# EAGLE design HV DCDC 4-22-2016  (EAGLE 7.2.0)
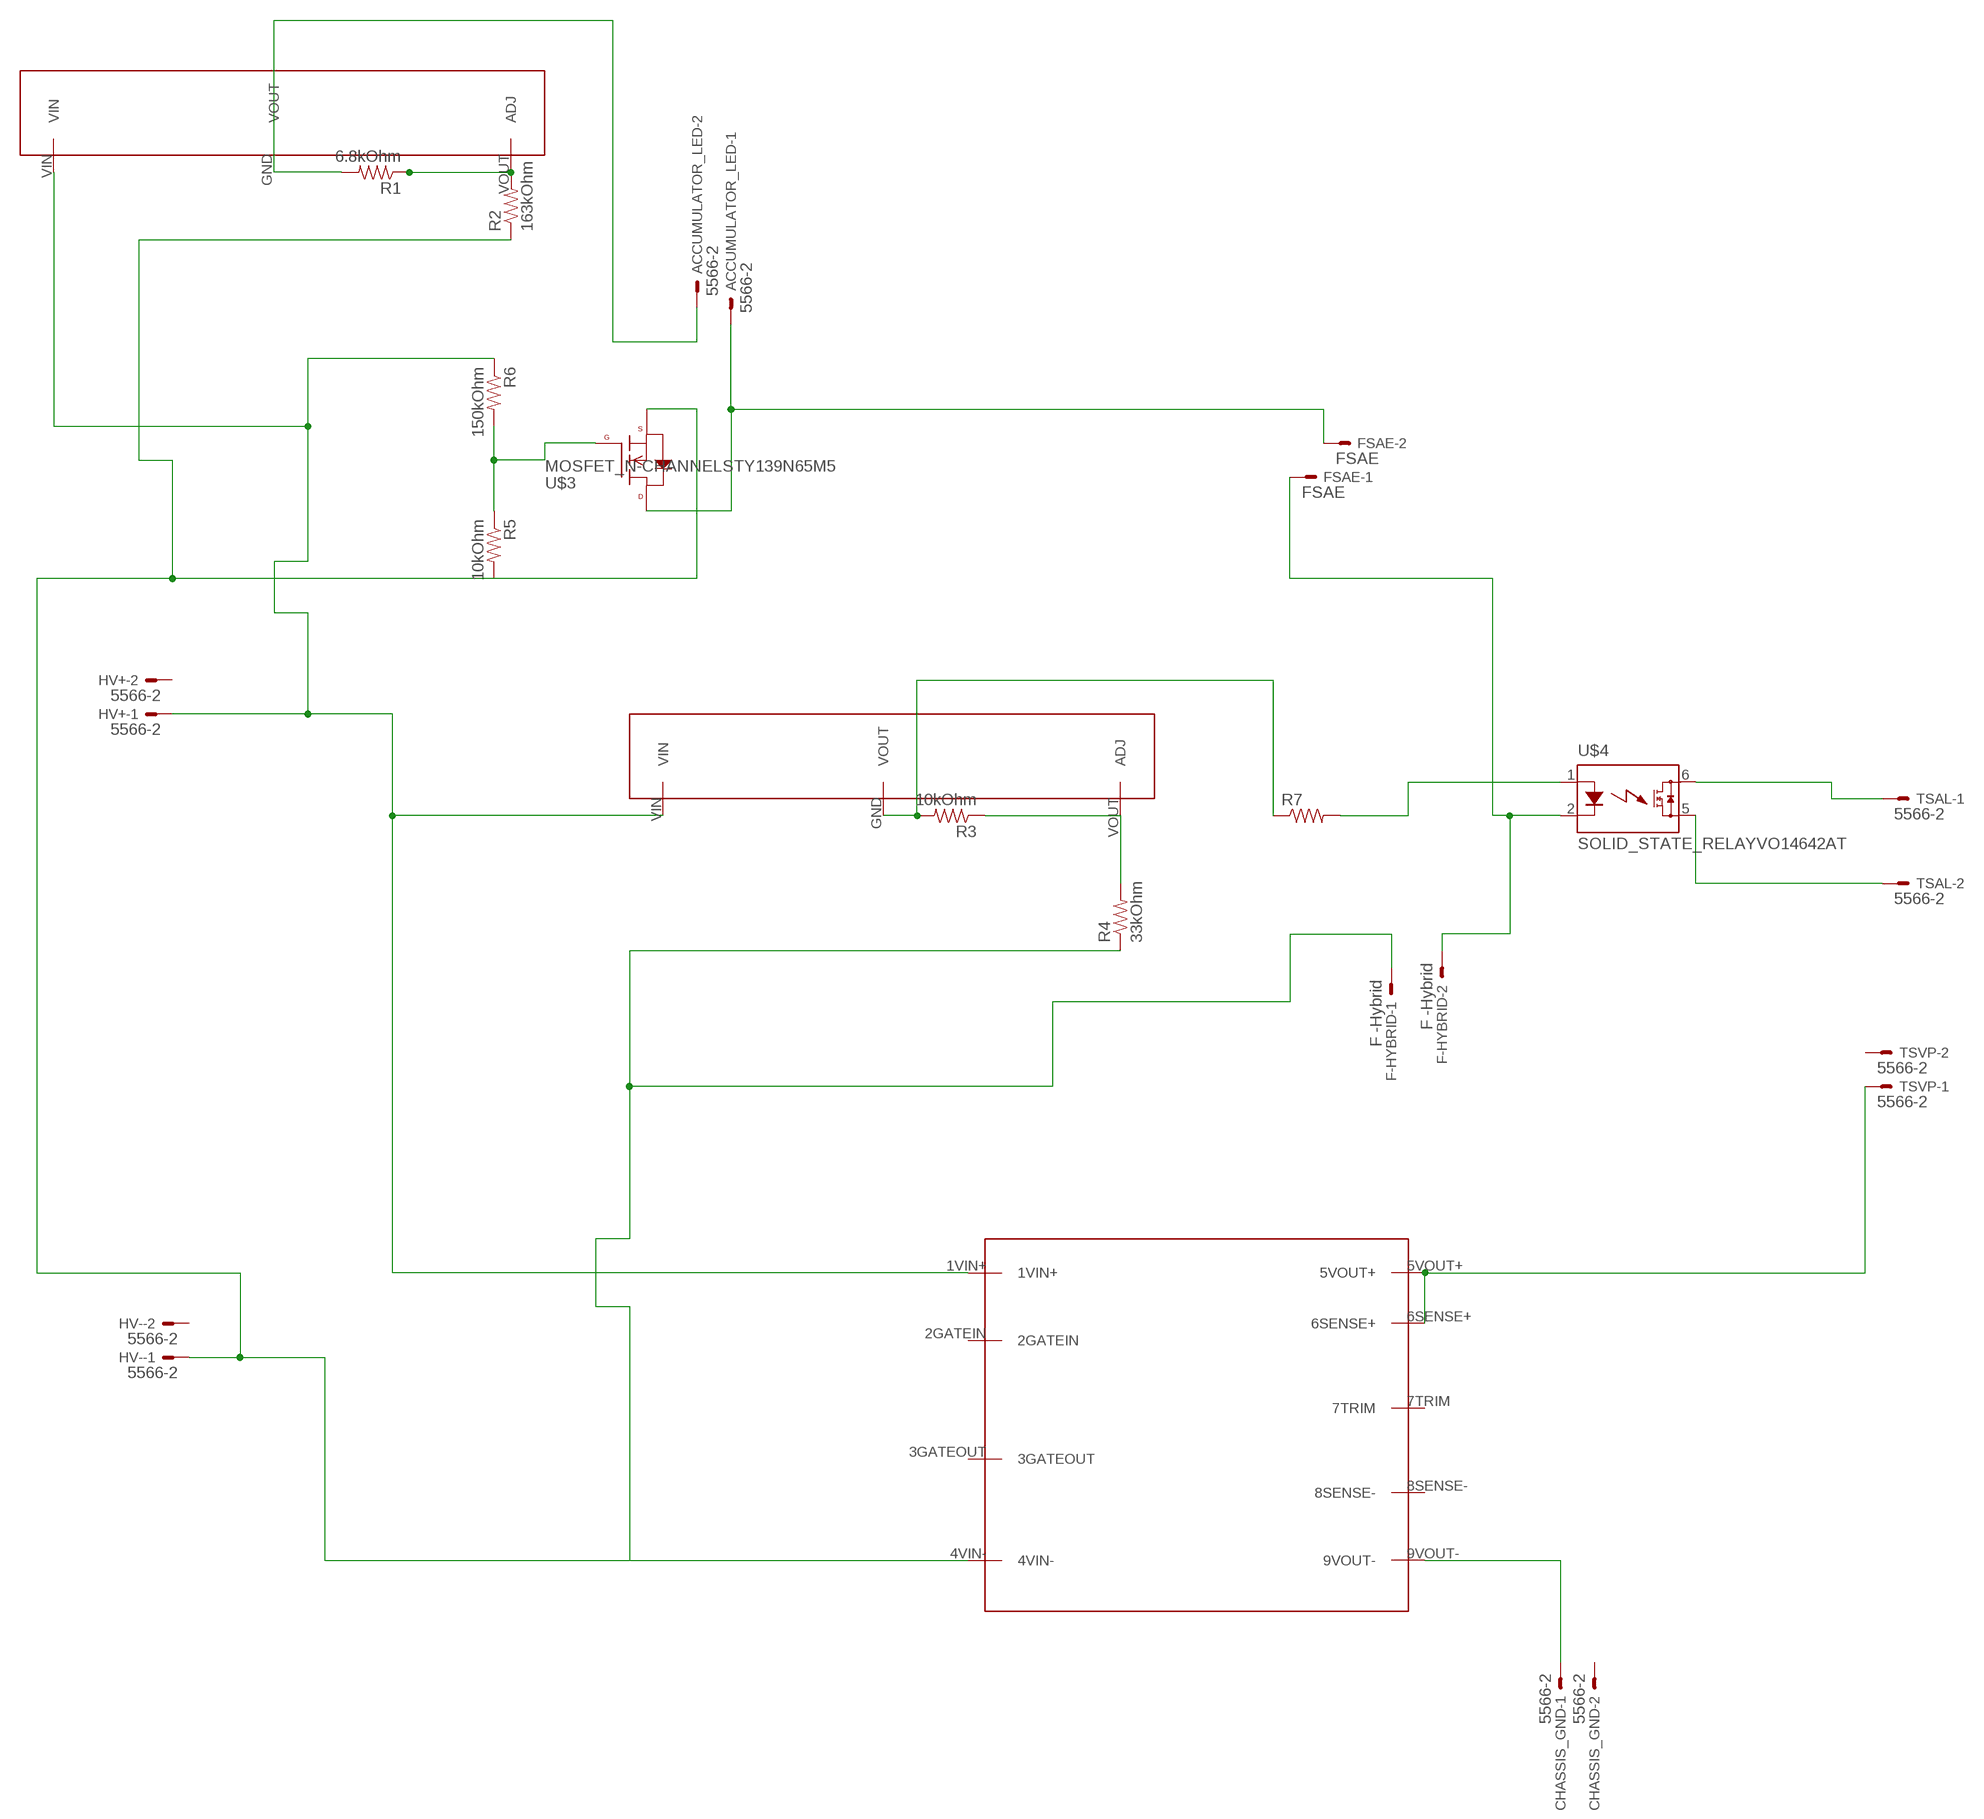
[diagram p0: schematic, sheet 1]

## Parts
ACCUMULATOR_LED  5566-2  [5566-2]
CHASSIS_GND  5566-2  [5566-2]
F-HYBRID  F -Hybrid  5566-2  [5566-2]
FSAE  FSAE  5566-2  [5566-2]
HV+  5566-2  [5566-2]
HV-  5566-2  [5566-2]
R1  6.8kOhm  RESISTORAXIAL-0.3  [AXIAL-0.3]
R2  163kOhm  RESISTORAXIAL-0.3  [AXIAL-0.3]
R3  10kOhm  RESISTORAXIAL-0.3  [AXIAL-0.3]
R4  33kOhm  RESISTORAXIAL-0.3  [AXIAL-0.3]
R5  10kOhm  RESISTORAXIAL-0.3  [AXIAL-0.3]
R6  150kOhm  RESISTORAXIAL-0.3  [AXIAL-0.3]
R7  RESISTORAXIAL-0.3  [AXIAL-0.3]
TSAL  5566-2  [5566-2]
TSVP  5566-2  [5566-2]
U$3  MOSFET_N-CHANNELSTY139N65M5  [TO-264_MAX247]
U$4  SOLID_STATE_RELAYVO14642AT  [DIL06]
U$5  HV_DCDC_NEW  [HV_DCDC_NEW]
U$6  HV_LIN_REG  [HV_LIN_REG14MM]
U$7  HV_LIN_REG  [HV_LIN_REG14MM]

## Nets
N$1: TSAL.1 U$4.6(IO1)
N$2: ACCUMULATOR_LED.1 FSAE.2 U$3.P2(DRAIN)
N$3: HV+.1 R6.P$1 U$5.1VIN+ U$6.VIN U$7.VIN
N$4: R5.P$1 R6.P$2 U$3.P1(GATE)
N$6: F-HYBRID.2 FSAE.1 U$4.2(LED-)
N$7: R3.P$2 R7.P$1 U$6.GND(VOUT)
N$8: R3.P$1 R4.P$2 U$6.VOUT(ADJ)
N$9: F-HYBRID.1 HV-.1 R2.P$1 R4.P$1 R5.P$2 U$3.P3(SOURCE) U$5.4VIN-
N$11: TSAL.2 U$4.5(IO2)
N$12: TSVP.1 U$5.5VOUT+ U$5.6SENSE+
N$13: R1.P$1 R2.P$2 U$7.VOUT(ADJ)
N$14: ACCUMULATOR_LED.2 R1.P$2 U$7.GND(VOUT)
N$18: CHASSIS_GND.1 U$5.9VOUT-
N$19: R7.P$2 U$4.1(LED+)
Unconnected: CHASSIS_GND.2 HV+.2 HV-.2 TSVP.2 U$5.2GATEIN U$5.3GATEOUT U$5.7TRIM U$5.8SENSE-

## Library data of the parts
ACCUMULATOR_LED CHASSIS_GND F-HYBRID FSAE HV+ HV- TSAL TSVP = con-molex:5566-2: Mini FIT connector 2 pol Source: http://www.molex.com; OC_FARNELL: 1822072; OC_NEWARK: unknown
R1-R7 = HyTech 2016-2-27-2016:RESISTOR: Resistor Basic schematic elements and footprints for 0603, 1206, and PTH resistors.
U$3 = HyTech 2016-2-27-2016:MOSFET_N-CHANNEL: N-Channel MOSFET Mode Field Effect Transistor
U$4 = HyTech 2016-2-27-2016:SOLID_STATE_RELAY: Configured for DC only
U$5 = HyTech 2016-4-19-2016:HV_DCDC_NEW
U$6 U$7 = HyTech 2016-4-19-2016:HV_LIN_REG

## Board
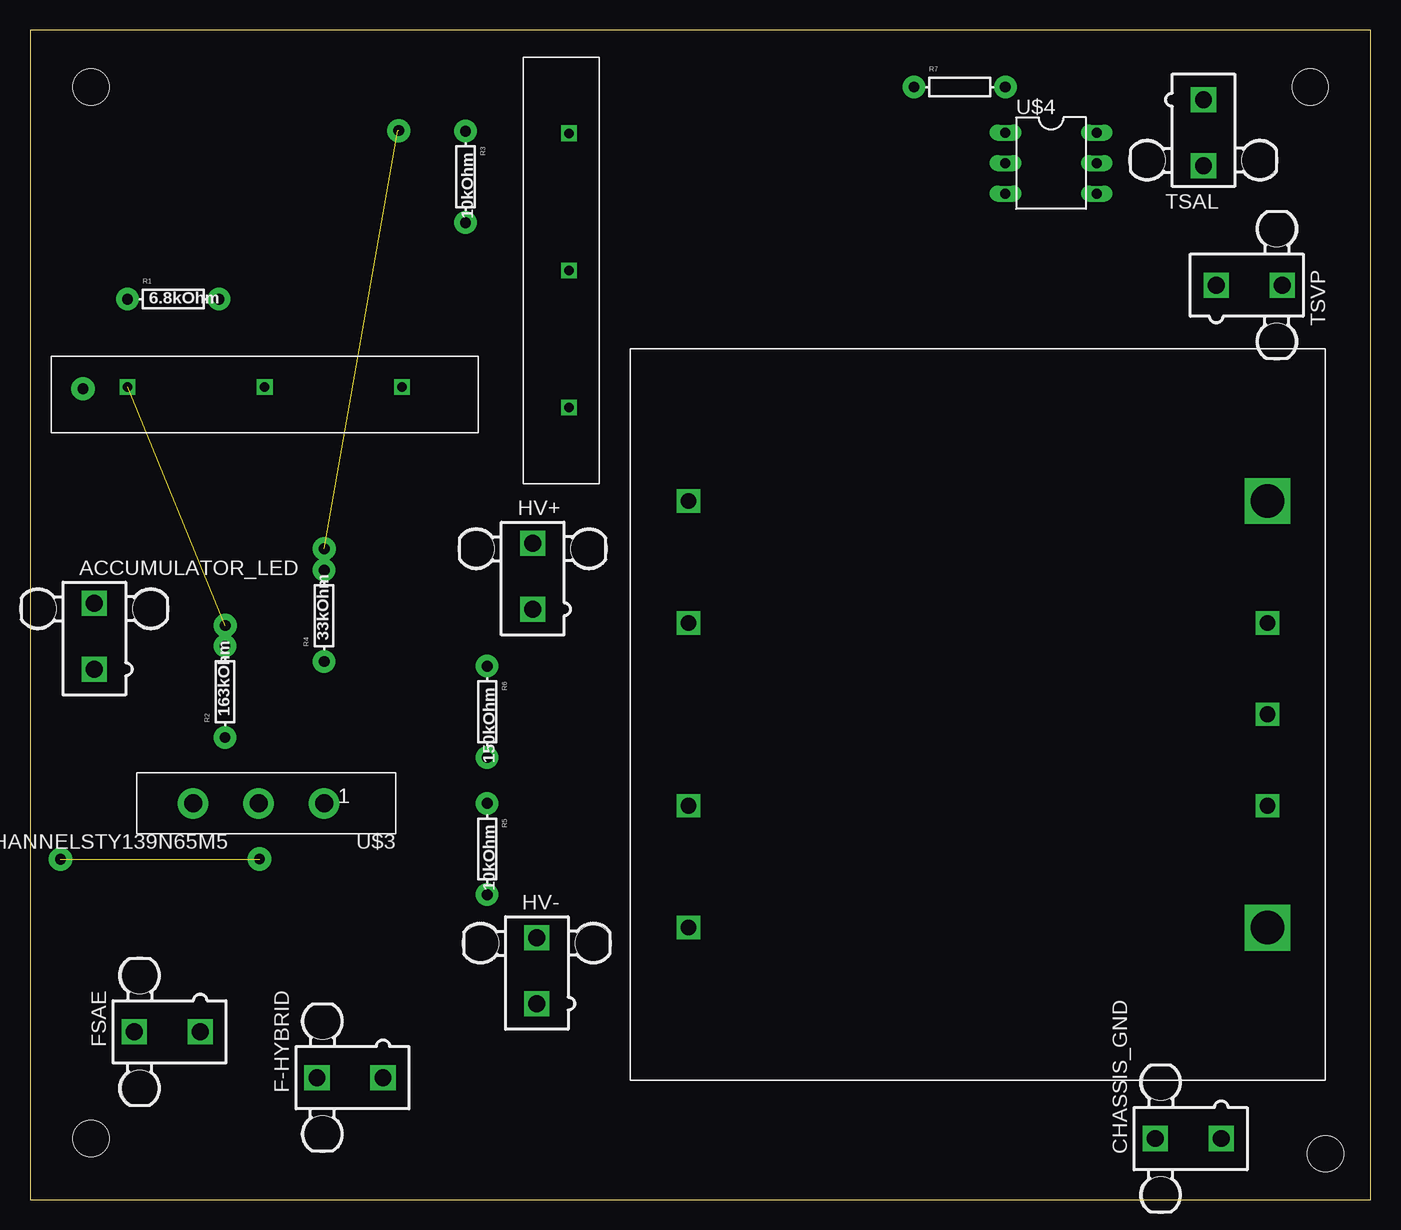
[diagram p1: board, top side]
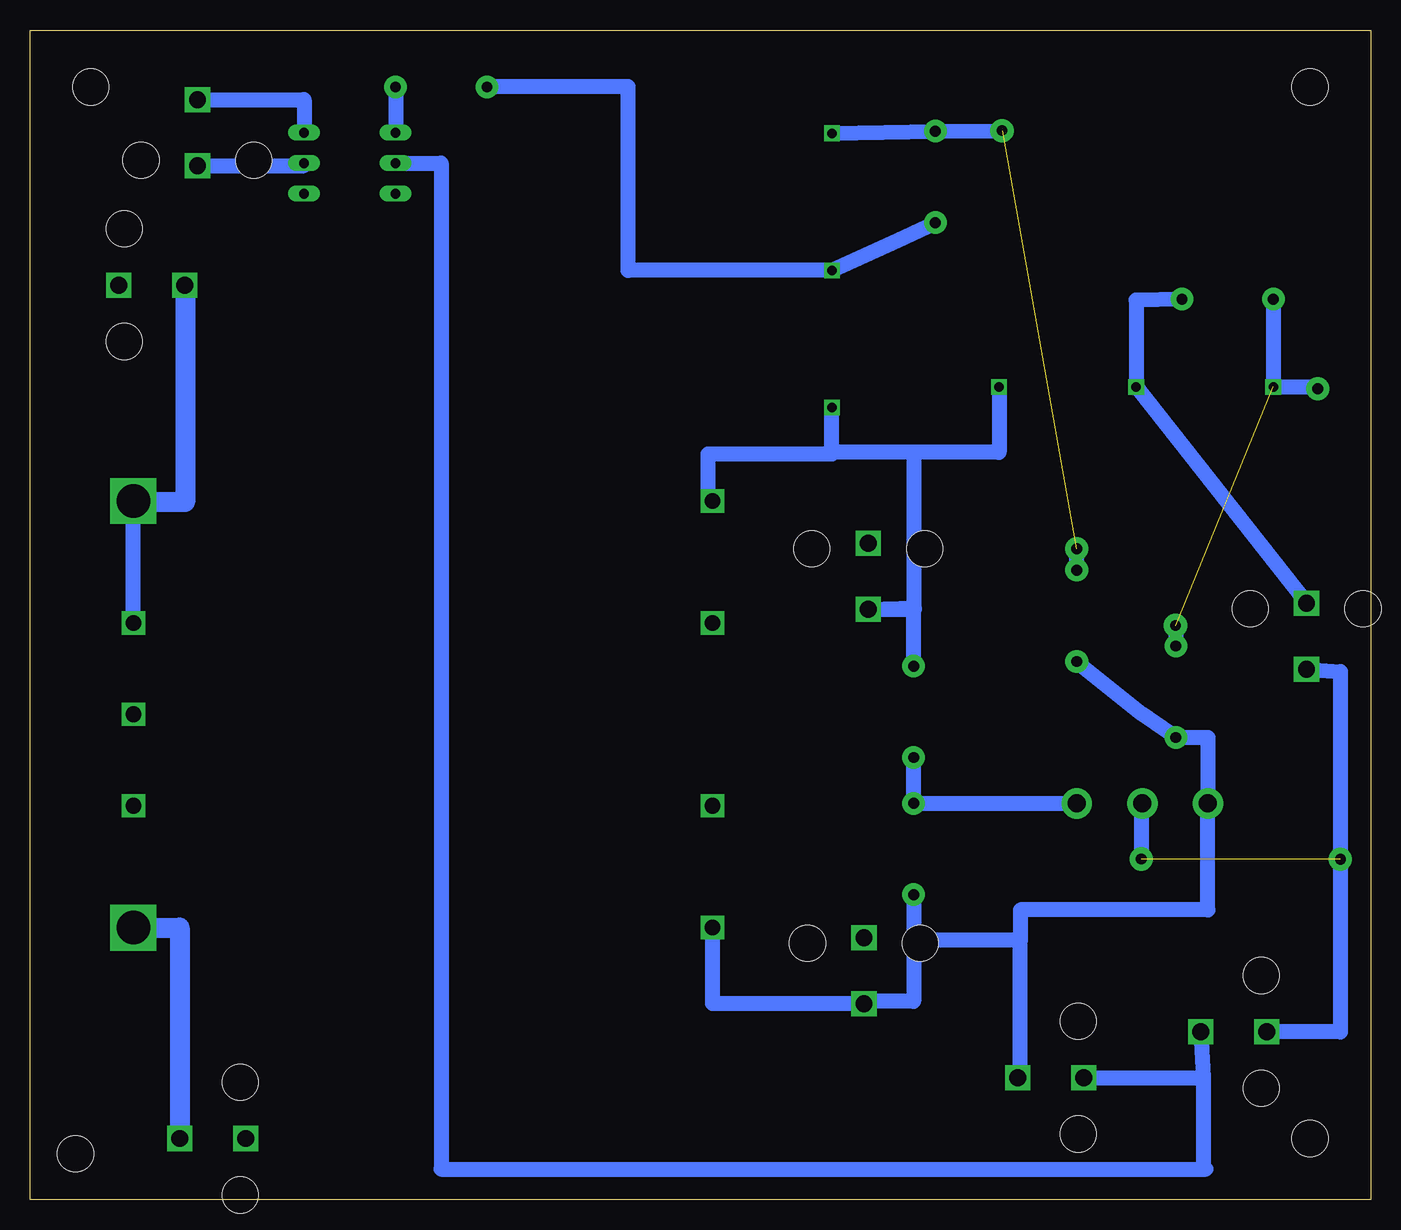
[diagram p2: board, bottom side, seen from below]

Size 111.74 x 97.46 mm. Coordinates in mm from the lower left corner, seen from the top.
Outline: 0,0 111.74,0 111.74,97.46 0,97.46 0,0
Copper layers (1*16): Top 0.035mm / dielectric 1.5mm / Bottom 0.035mm
Design rules "default": minimum track width 10mil, minimum drill 24mil, track to track 8mil, track to pad 8mil, pad to pad 8mil, via to via 8mil, smd to smd 8mil, copper to edge 40mil, drill to drill 8mil, minimum pad ring 10mil, minimum via ring 8mil, stop-mask expansion 4mil, vias tented up to drill 0mil, thermal gap 10mil
Holes 3 mm at 107.95,3.81 5.08,5.08 5.08,92.71 106.68,92.71

### Footprints (pad centres in the part's own frame; a part is rotated, then mirrored left to right if it is on the bottom)
5566-2 = drill 1.4 square: 1 0,-2.75; 2 0,2.75 | hole 3: 4.7,2.29; -4.7,2.29
AXIAL-0.3 = drill 0.9 pad 1.88: P$1 -3.81,0; P$2 3.81,0
TO-264_MAX247 = drill 1.5 pad 2.54: P1 -5.461,0; P2 0,0; P3 5.461,0
DIL06 = drill 0.813 long: 1 -2.54,-3.81; 2 0,-3.81; 3 2.54,-3.81; 4 2.54,3.81; 5 0,3.81; 6 -2.54,3.81
HV_DCDC_NEW = drill 1.3 square: 1VIN+ 5.08,-12.7; 2GATEIN 5.08,-22.86; 3GATEOUT 5.08,-38.1; 4VIN- 5.08,-48.26; 6SENSE+ 53.34,-22.86; 7TRIM 53.34,-30.48; 8SENSE- 53.34,-38.1 | drill 2.8 square: 5VOUT+ 53.34,-12.7; 9VOUT- 53.34,-48.26
HV_LIN_REG14MM = drill 0.8 square: GND 17.78,-3.81; VIN 6.35,-3.81; VOUT 29.21,-3.81

### Placement (x,y rotation side)
ACCUMULATOR_LED  5.36,46.94 0 top
CHASSIS_GND  96.52,5.08 90 top
F-HYBRID  26.67,10.16 90 top
FSAE  11.43,13.97 90 top
HV+  41.88,51.94 0 top
HV-  42.24,19.08 0 top
R1  11.94,75.03 0 top
R2  16.26,42.32 90 top
R3  36.3,85.22 270 top
R4  24.51,48.64 90 top
R5  38.1,29.21 270 top
R6  38.1,40.64 270 top
R7  77.47,92.71 0 top
TSAL  97.79,88.9 180 top
TSVP  101.6,76.2 270 top
U$3  19.05,33.02 180 top
U$4  85.09,86.36 270 top
U$5  49.78,70.92 0 top
U$6  41.1,59.64 90 top
U$7  37.34,63.91 180 top

### Tracks (layer width: path | path; a pad name or v marks a point on that pad's centre or on a via)
N$1
  Bottom 1.27: TSAL.1 88.9,91.65 U$4.6
N$2  (via drill 0.9 pad 1.93)  (1 unrouted)
  Bottom 1.27: FSAE.2 2.54,13.97 v2.54,28.35 2.54,43.99 ACCUMULATOR_LED.1 | U$3.P2 19.13,33.02 v19.13,28.37 19.13,28.3
N$3
  Bottom 1.27: R6.P$1 38.1,49.32 HV+.1 38.05,49.19 38.05,62.26 | U$5.1VIN+ 55.22,58.22 55.22,62.13 44.91,62.13 U$6.VIN 44.91,62.26 38.05,62.26 | U$7.VIN 30.99,62.26 38.05,62.26
N$4
  Bottom 1.27: R6.P$2 R5.P$1 U$3.P1
N$6
  Bottom 1.27: U$4.2 77.47,86.36 77.47,2.54 13.97,2.54 | 13.97,2.54 13.76,2.54 | FSAE.1 13.97,10.16 | 13.97,10.16 13.97,2.54 | F-HYBRID.2 13.97,10.16
N$7
  Bottom 1.27: R7.P$1 73.66,92.74 61.9,92.74 61.9,77.42 U$6.GND 39.42,79.93 R3.P$2
N$8  (via drill 0.9 pad 1.93)  (2 unrouted)
  Bottom 1.27: U$6.VOUT 36.27,89.03 R3.P$1 30.66,89.05 | R4.P$2 v24.51,54.23
  other vias: 30.73,89.08
N$9
  Bottom 1.27: R5.P$2 38.1,21.59 | 38.1,21.59 38.1,16.51 42.24,16.51 HV-.1 54.86,16.33 U$5.4VIN- | 29.21,21.59 38.1,21.59 | F-HYBRID.1 29.21,10.16 29.21,21.59 | 29.21,21.59 29.21,24.13 13.59,24.13 U$3.P3 13.59,38.51 R2.P$1 19.1,40.49 R4.P$1
N$11
  Bottom 1.27: TSAL.2 88.9,86.15 U$4.5
N$12
  Bottom 1.27: U$5.6SENSE+ U$5.5VOUT+
  Bottom 1.676: TSVP.1 98.81,76.2 98.81,58.12 103.12,58.12 U$5.5VOUT+
N$13  (via drill 0.9 pad 1.93)  (1 unrouted)
  Bottom 1.27: v4.42,67.56 4.42,67.72 U$7.VOUT R1.P$1 | v16.28,47.83 R2.P$2
N$14
  Bottom 1.27: R1.P$2 19.56,74.96 U$7.GND ACCUMULATOR_LED.2
N$18
  Bottom 1.676: U$5.9VOUT- 99.27,22.66 CHASSIS_GND.1
N$19
  Bottom 1.27: R7.P$2 U$4.1